# Altium schematic sheet 10- RS485.SchDoc: RS485
size 420 x 297 mm; Revision: 1.0; SheetNumber: 10; SheetTotal: 13; Project: LOW LEVEL ECU
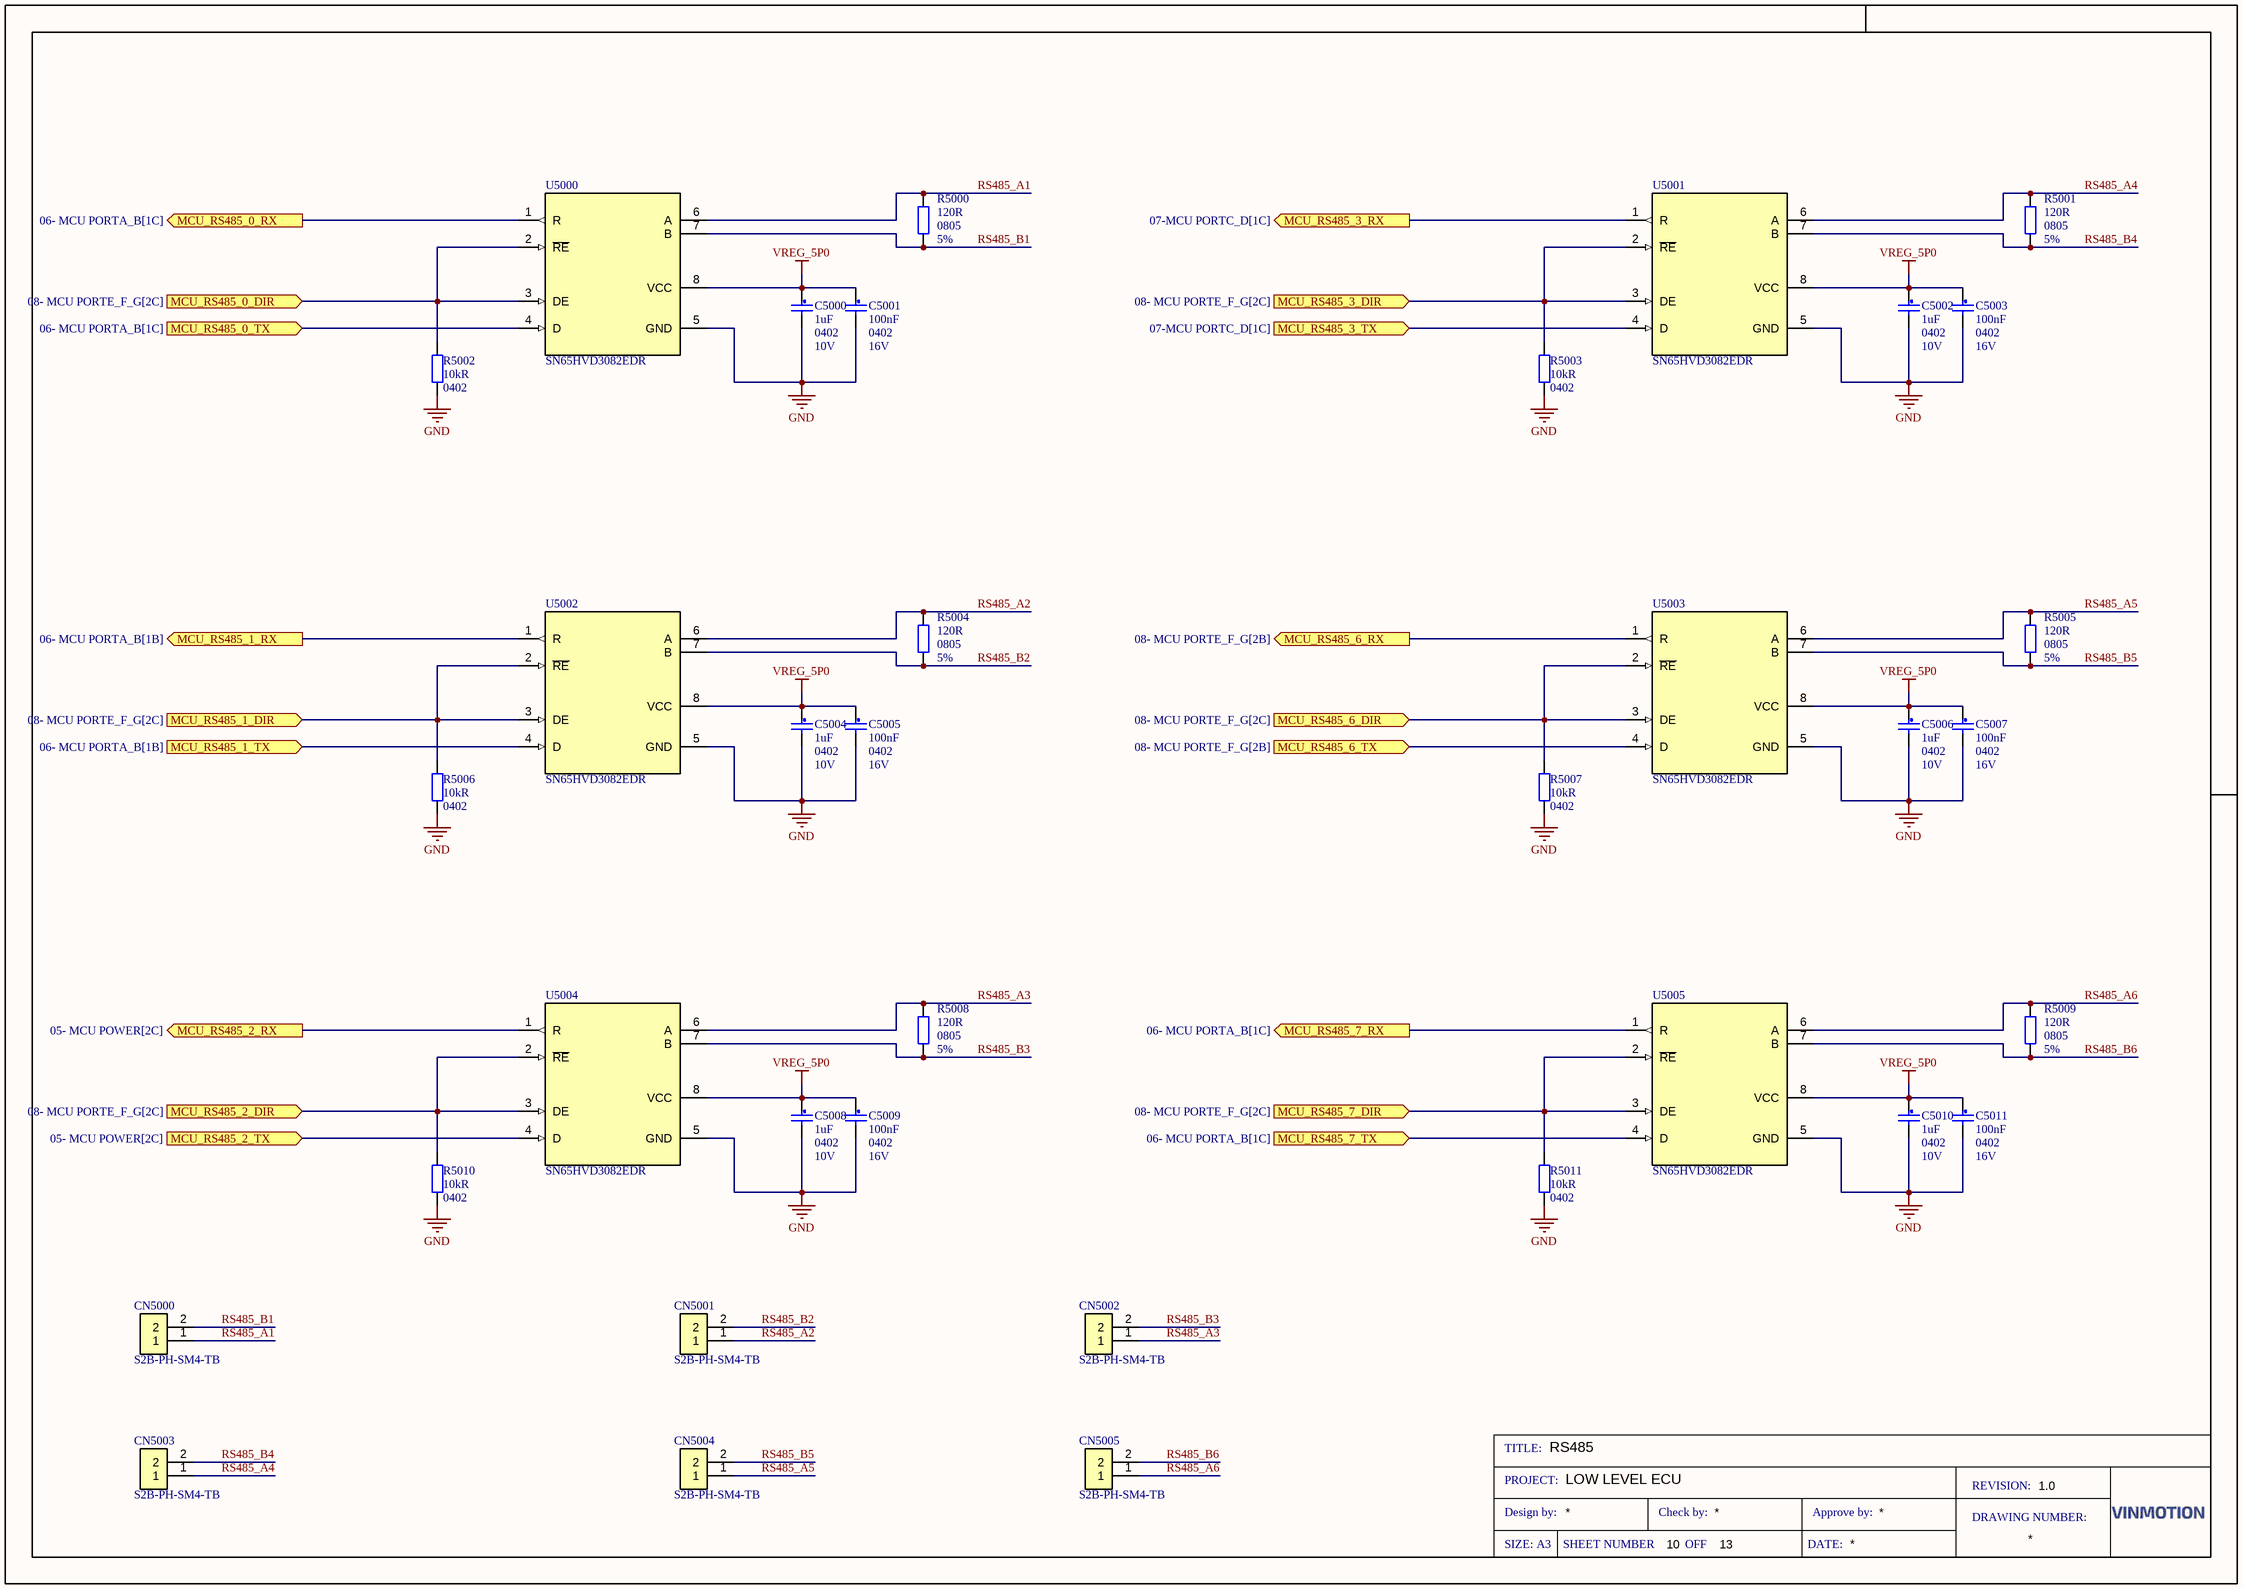
[diagram p0: 10- RS485.SchDoc]

## Parts
C5000  value 1uF  Case/Package: 0402  Rated DC Voltage (URdc): 10V  [CAP0402]  (hidden comment: CL05X105KP5NNNC)
C5001  Capacitance: 100nF  Case/Package: 0402  Voltage Rating (DC): 16V  [CAP0402]  (hidden comment: 0402YC104KAT2A)
C5002  value 1uF  Case/Package: 0402  Rated DC Voltage (URdc): 10V  [CAP0402]  (hidden comment: CL05X105KP5NNNC)
C5003  Capacitance: 100nF  Case/Package: 0402  Voltage Rating (DC): 16V  [CAP0402]  (hidden comment: 0402YC104KAT2A)
C5004  value 1uF  Case/Package: 0402  Rated DC Voltage (URdc): 10V  [CAP0402]  (hidden comment: CL05X105KP5NNNC)
C5005  Capacitance: 100nF  Case/Package: 0402  Voltage Rating (DC): 16V  [CAP0402]  (hidden comment: 0402YC104KAT2A)
C5006  value 1uF  Case/Package: 0402  Rated DC Voltage (URdc): 10V  [CAP0402]  (hidden comment: CL05X105KP5NNNC)
C5007  Capacitance: 100nF  Case/Package: 0402  Voltage Rating (DC): 16V  [CAP0402]  (hidden comment: 0402YC104KAT2A)
C5008  value 1uF  Case/Package: 0402  Rated DC Voltage (URdc): 10V  [CAP0402]  (hidden comment: CL05X105KP5NNNC)
C5009  Capacitance: 100nF  Case/Package: 0402  Voltage Rating (DC): 16V  [CAP0402]  (hidden comment: 0402YC104KAT2A)
C5010  value 1uF  Case/Package: 0402  Rated DC Voltage (URdc): 10V  [CAP0402]  (hidden comment: CL05X105KP5NNNC)
C5011  Capacitance: 100nF  Case/Package: 0402  Voltage Rating (DC): 16V  [CAP0402]  (hidden comment: 0402YC104KAT2A)
CN5000  S2B-PH-SM4-TB  [S2B-PH-SM4-TB]
CN5001  S2B-PH-SM4-TB  [S2B-PH-SM4-TB]
CN5002  S2B-PH-SM4-TB  [S2B-PH-SM4-TB]
CN5003  S2B-PH-SM4-TB  [S2B-PH-SM4-TB]
CN5004  S2B-PH-SM4-TB  [S2B-PH-SM4-TB]
CN5005  S2B-PH-SM4-TB  [S2B-PH-SM4-TB]
R5000  value 120R  Case/Package: 0805  Tolerance: 5%  [RES0805]  (hidden comment: ERJ-P06J121V)
R5001  value 120R  Case/Package: 0805  Tolerance: 5%  [RES0805]  (hidden comment: ERJ-P06J121V)
R5002  Resistance: 10kR  Case/Package: 0402  [RES0402]  (hidden comment: ERJ2GEJ103X)
R5003  Resistance: 10kR  Case/Package: 0402  [RES0402]  (hidden comment: ERJ2GEJ103X)
R5004  value 120R  Case/Package: 0805  Tolerance: 5%  [RES0805]  (hidden comment: ERJ-P06J121V)
R5005  value 120R  Case/Package: 0805  Tolerance: 5%  [RES0805]  (hidden comment: ERJ-P06J121V)
R5006  Resistance: 10kR  Case/Package: 0402  [RES0402]  (hidden comment: ERJ2GEJ103X)
R5007  Resistance: 10kR  Case/Package: 0402  [RES0402]  (hidden comment: ERJ2GEJ103X)
R5008  value 120R  Case/Package: 0805  Tolerance: 5%  [RES0805]  (hidden comment: ERJ-P06J121V)
R5009  value 120R  Case/Package: 0805  Tolerance: 5%  [RES0805]  (hidden comment: ERJ-P06J121V)
R5010  Resistance: 10kR  Case/Package: 0402  [RES0402]  (hidden comment: ERJ2GEJ103X)
R5011  Resistance: 10kR  Case/Package: 0402  [RES0402]  (hidden comment: ERJ2GEJ103X)
U5000  SN65HVD3082EDR  [SOIC127P590X175-8N]
U5001  SN65HVD3082EDR  [SOIC127P590X175-8N]
U5002  SN65HVD3082EDR  [SOIC127P590X175-8N]
U5003  SN65HVD3082EDR  [SOIC127P590X175-8N]
U5004  SN65HVD3082EDR  [SOIC127P590X175-8N]
U5005  SN65HVD3082EDR  [SOIC127P590X175-8N]

## Ports
MCU_RS485_0_DIR (in, see 08- MCU PORTE_F_G[2C]), MCU_RS485_0_RX (out, see 06- MCU PORTA_B[1C]), MCU_RS485_0_TX (in, see 06- MCU PORTA_B[1C]), MCU_RS485_1_DIR (in, see 08- MCU PORTE_F_G[2C]), MCU_RS485_1_RX (out, see 06- MCU PORTA_B[1B]), MCU_RS485_1_TX (in, see 06- MCU PORTA_B[1B]), MCU_RS485_2_DIR (in, see 08- MCU PORTE_F_G[2C]), MCU_RS485_2_RX (out, see 05- MCU POWER[2C]), MCU_RS485_2_TX (in, see 05- MCU POWER[2C]), MCU_RS485_3_DIR (in, see 08- MCU PORTE_F_G[2C]), MCU_RS485_3_RX (out, see 07-MCU PORTC_D[1C]), MCU_RS485_3_TX (in, see 07-MCU PORTC_D[1C]), MCU_RS485_6_DIR (in, see 08- MCU PORTE_F_G[2C]), MCU_RS485_6_RX (out, see 08- MCU PORTE_F_G[2B]), MCU_RS485_6_TX (in, see 08- MCU PORTE_F_G[2B]), MCU_RS485_7_DIR (in, see 08- MCU PORTE_F_G[2C]), MCU_RS485_7_RX (out, see 06- MCU PORTA_B[1C]), MCU_RS485_7_TX (in, see 06- MCU PORTA_B[1C])

## Nets
GND: C5000.2 C5001.2 C5002.2 C5003.2 C5004.2 C5005.2 C5006.2 C5007.2 C5008.2 C5009.2 C5010.2 C5011.2 R5002.1 R5003.1 R5006.1 R5007.1 R5010.1 R5011.1 U5000.5(GND) U5001.5(GND) U5002.5(GND) U5003.5(GND) U5004.5(GND) U5005.5(GND)
VREG_5P0: C5000.1 C5001.1 C5002.1 C5003.1 C5004.1 C5005.1 C5006.1 C5007.1 C5008.1 C5009.1 C5010.1 C5011.1 U5000.8(VCC) U5001.8(VCC) U5002.8(VCC) U5003.8(VCC) U5004.8(VCC) U5005.8(VCC)
MCU_RS485_0_DIR: R5002.2 U5000.2(~{RE}) U5000.3(DE) ; port MCU_RS485_0_DIR
MCU_RS485_0_RX: U5000.1(R) ; port MCU_RS485_0_RX
MCU_RS485_0_TX: U5000.4(D) ; port MCU_RS485_0_TX
MCU_RS485_1_DIR: R5006.2 U5002.2(~{RE}) U5002.3(DE) ; port MCU_RS485_1_DIR
MCU_RS485_1_RX: U5002.1(R) ; port MCU_RS485_1_RX
MCU_RS485_1_TX: U5002.4(D) ; port MCU_RS485_1_TX
MCU_RS485_2_DIR: R5010.2 U5004.2(~{RE}) U5004.3(DE) ; port MCU_RS485_2_DIR
MCU_RS485_2_RX: U5004.1(R) ; port MCU_RS485_2_RX
MCU_RS485_2_TX: U5004.4(D) ; port MCU_RS485_2_TX
MCU_RS485_3_DIR: R5003.2 U5001.2(~{RE}) U5001.3(DE) ; port MCU_RS485_3_DIR
MCU_RS485_3_RX: U5001.1(R) ; port MCU_RS485_3_RX
MCU_RS485_3_TX: U5001.4(D) ; port MCU_RS485_3_TX
MCU_RS485_6_DIR: R5007.2 U5003.2(~{RE}) U5003.3(DE) ; port MCU_RS485_6_DIR
MCU_RS485_6_RX: U5003.1(R) ; port MCU_RS485_6_RX
MCU_RS485_6_TX: U5003.4(D) ; port MCU_RS485_6_TX
MCU_RS485_7_DIR: R5011.2 U5005.2(~{RE}) U5005.3(DE) ; port MCU_RS485_7_DIR
MCU_RS485_7_RX: U5005.1(R) ; port MCU_RS485_7_RX
MCU_RS485_7_TX: U5005.4(D) ; port MCU_RS485_7_TX
RS485_A1: CN5000.1 R5000.1 U5000.6(A)
RS485_A2: CN5001.1 R5004.1 U5002.6(A)
RS485_A3: CN5002.1 R5008.1 U5004.6(A)
RS485_A4: CN5003.1 R5001.1 U5001.6(A)
RS485_A5: CN5004.1 R5005.1 U5003.6(A)
RS485_A6: CN5005.1 R5009.1 U5005.6(A)
RS485_B1: CN5000.2 R5000.2 U5000.7(B)
RS485_B2: CN5001.2 R5004.2 U5002.7(B)
RS485_B3: CN5002.2 R5008.2 U5004.7(B)
RS485_B4: CN5003.2 R5001.2 U5001.7(B)
RS485_B5: CN5004.2 R5005.2 U5003.7(B)
RS485_B6: CN5005.2 R5009.2 U5005.7(B)

## Notes on the sheet
- TITLE:
- PROJECT:
- Design by:
- Check by:
- Approve by:
- DRAWING NUMBER:
- REVISION:
- SIZE: A3
- SHEET NUMBER
- OFF
- DATE:

## Library data of the parts
C5000 C5002 C5004 C5006 C5008 C5010 = CMP-01106-1: CAP CER 1UF 10V X6S 0402; Manufacturer: Samsung; Capacitor Type: Ceramic; Multilayer: Yes; Tolerance  (fill in as +-): 10%; Max Operating Temperature: 105°C; Category: Ceramic Capacitors; Dielectric Material: Ceramic; Height: 0.55mm; JESD-609 Code: e3; Length: 1mm; Manufacturer Part Number: CL05X105KP5NNNC; Min Operating Temperature: -55°C; Mounting Technology: Surface Mount; Pins: 2; Package Shape: Rectangular; Package Style: SMTMeter; Packaging: Tape and Reel; Tolerance (fill in as +-): 10%; Reach SVHC Compliant: Yes; RoHS Compliant: Yes; Temperature Characteristics Code: X6S; Terminal Finish: Nickel; Termination: Wraparound; Width: 0.5mm
C5001 C5003 C5005 C5007 C5009 C5011 = CMP-00988-1: CAP CER 0.1UF 16V X7R 0402; Manufacturer 1: KYOCERA AVX; Crossable(YES/NO): YES; Mount Type(SMD/TH): SMD; Case Code (Imperial): 0402; Case Code (Metric): 1005; Dielectric: X7R; Manufacturer Part Number 1: 0402YC104KAT2A; Max Operating Temperature: 125°C; Min Operating Temperature: -55°C; Mount: Surface Mount; Voltage Rating: 16V
CN5000-CN5005 = CMP-01142-1: CONN HEADER SMD R/A 2POS 2MM; Manufacturer: JST; Manufacturer Part Number: S2BPHSM4TBLFSN; Current Rating: 2A; Insulation Resistance: 1GΩ; Number of Contacts: 2; Voltage Rating: 100V; Housing Color: Natural; Category: Headers and Wire Housings; Color: White; Contact Material: Copper, Tin; Contact Plating: Tin; Height: 5.5mm; Housing Material: Nylon; Lead Free: Lead Free; Lead Pitch: 2mm; Max Operating Temperature: 85°C; Min Operating Temperature: -25°C; Number of Positions: 2; Number of Rows: 1; RoHS: Compliant; Voltage Rating (AC): 100V
R5000 R5001 R5004 R5005 R5008 R5009 = CMP-01121-1: RES SMD 120 OHM 5% 1/2W 0805; Manufacturer: Panasonic; Package Height: 0.6mm; Package Length: 2mm; Package Width: 1.25mm; Power: 500mW; Rated Temperature: 70°C; Reference Standard: AEC-Q200; Temperature Coefficient (ppm/Cel): 200; Working Voltage: 400V; Category: Chip SMD Resistors; Construction: Rectangular; JESD-609 Code: e3; Manufacturer Part Number: ERJ-P06J121V; Max Operating Temperature: 155°C; Min Operating Temperature: -55°C; Mounting Technology: Surface Mount; Pins: 2; Package Shape: Rectangular; Packaging: Tape and Reel; Reach SVHC Compliant: Yes; Resistor Type: FIXED RESISTOR; RoHS Compliant: Yes; Technology: METAL GLAZE/THICK FILM; Terminal Finish: Tin; Termination: Wraparound
R5002 R5003 R5006 R5007 R5010 R5011 = CMP-00039-6: RES SMD 10K OHM 5% 1/10W 0402; Manufacturer 1: Panasonic Electronic Components; Temperature Coefficient: 200ppm/°C; Max Power Dissipation: 100mW; Crossable(YES/NO): YES; Voltage Rating: 50V; Width: 0.02inch; Tolerance: 5%; Number of Terminations: 2; Max Operating Temperature: 155°C; Case Code (Imperial): 0402; Military Standard: Not; Lead Free: Lead Free; Length: 1mm; Manufacturer Part Number 1: ERJ2GEJ103X; Composition: Thick Film; Mount: Surface Mount; REACH SVHC: No SVHC; Mount Type(SMD/TH): SMD; Power Rating: 100mW; Radiation Hardening: No; Package Quantity: 1; Features: Automotive AEC-Q200; Case Code (Metric): 1005; Voltage Rating (DC): 50V; Termination: SMD/SMT; Contact Plating: Tin; Height: 0.35mm; Depth: 0.5mm; Min Operating Temperature: -55°C; Packaging: Cut Tape
U5000-U5005 = CMP-01120-1: IC TRANSCEIVER HALF 1/1 8SOIC; Manufacturer: Texas Instruments; Max Supply Voltage: 5.5V; Differential Output: Yes; Driver Number of Bits: 1; High Level Input Current-Max: 100uA; Input Characteristics: DIFFERENTIAL SCHMITT TRIGGER; Interface IC Type: LINE TRANSCEIVER; Max Supply Current: 900uA; Min Supply Voltage: 4.5V; Out Swing-Min: 1.5V; Output Low Current-Max: 8mA; Package Body Material: Plastic; Package Equivalence Code: SOP8,.25; Power Supplies: 5V; Qualification Status: Not Qualified; Receive Delay-Max: 200ns; Transmit Delay-Max: 1300ns; Category: RS-232 / RS-422 / RS-485 Interface ICs; Height - Seated (Max): 1.75mm; JESD-30 Code: R-PDSO-G8; JESD-609 Code: e4; Length: 4.9mm; Manufacturer Part Number: SN65HVD3082EDR; Max Operating Temperature: 85°C; Min Operating Temperature: -40°C; Moisture Sensitivity Level: 1; Channels: 1; Pins: 8; Case/Package: SOP; Package Shape: Rectangular; Package Style: SMALL OUTLINEMeter; Peak Reflow Temperature (Cel): 260°C; Reach SVHC Compliant: Yes; Receiver Number of Bits: 1; RoHS Compliant: Yes; Nominal Supply Voltage: 5V; Surface Mount: Yes; Technology: CMOS; Temperature Grade: INDUSTRIAL; Terminal Finish: Nickel; Terminal Form: Gull Wing; Terminal Pitch: 1.27mm; Terminal Position: DUAL; Width: 3.9mm